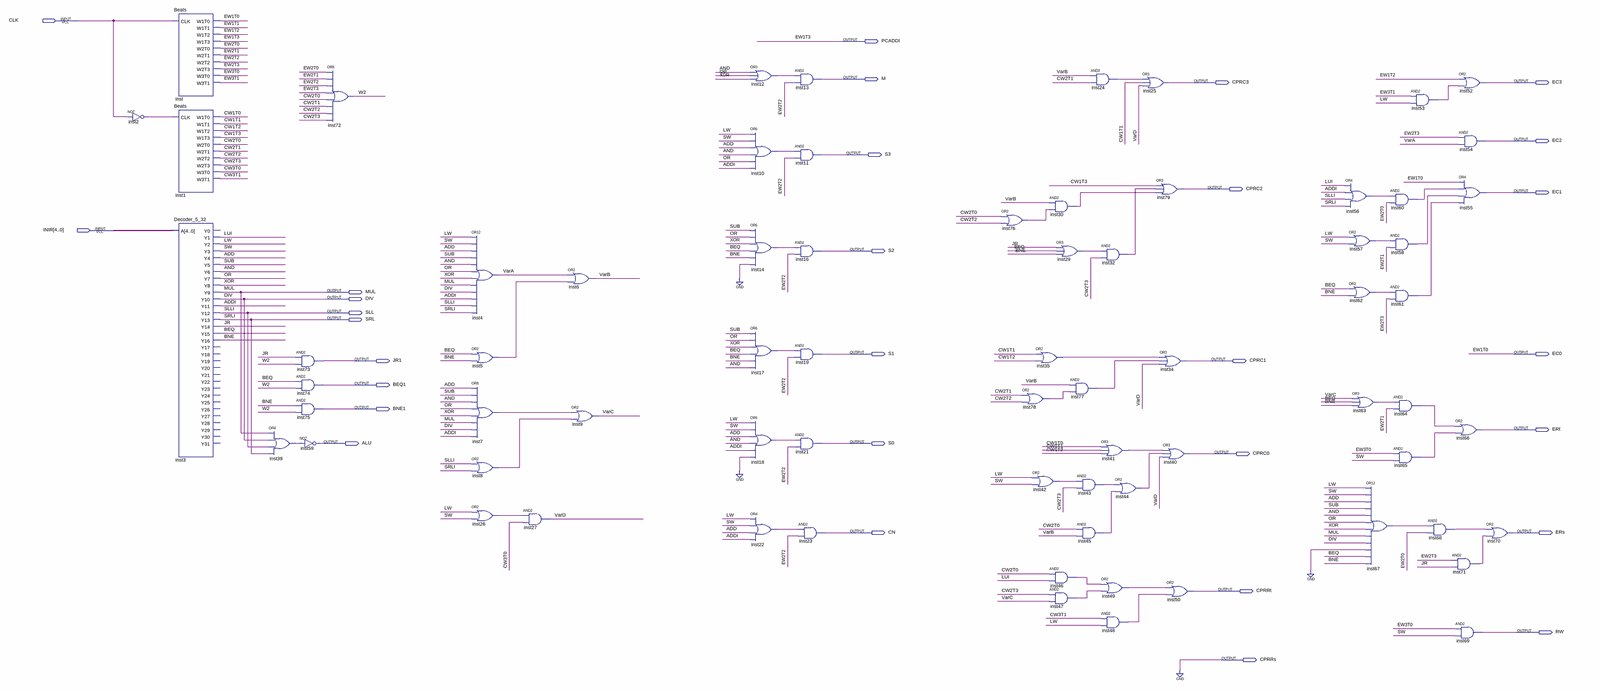
[diagram p0: schematic sheet, whole]
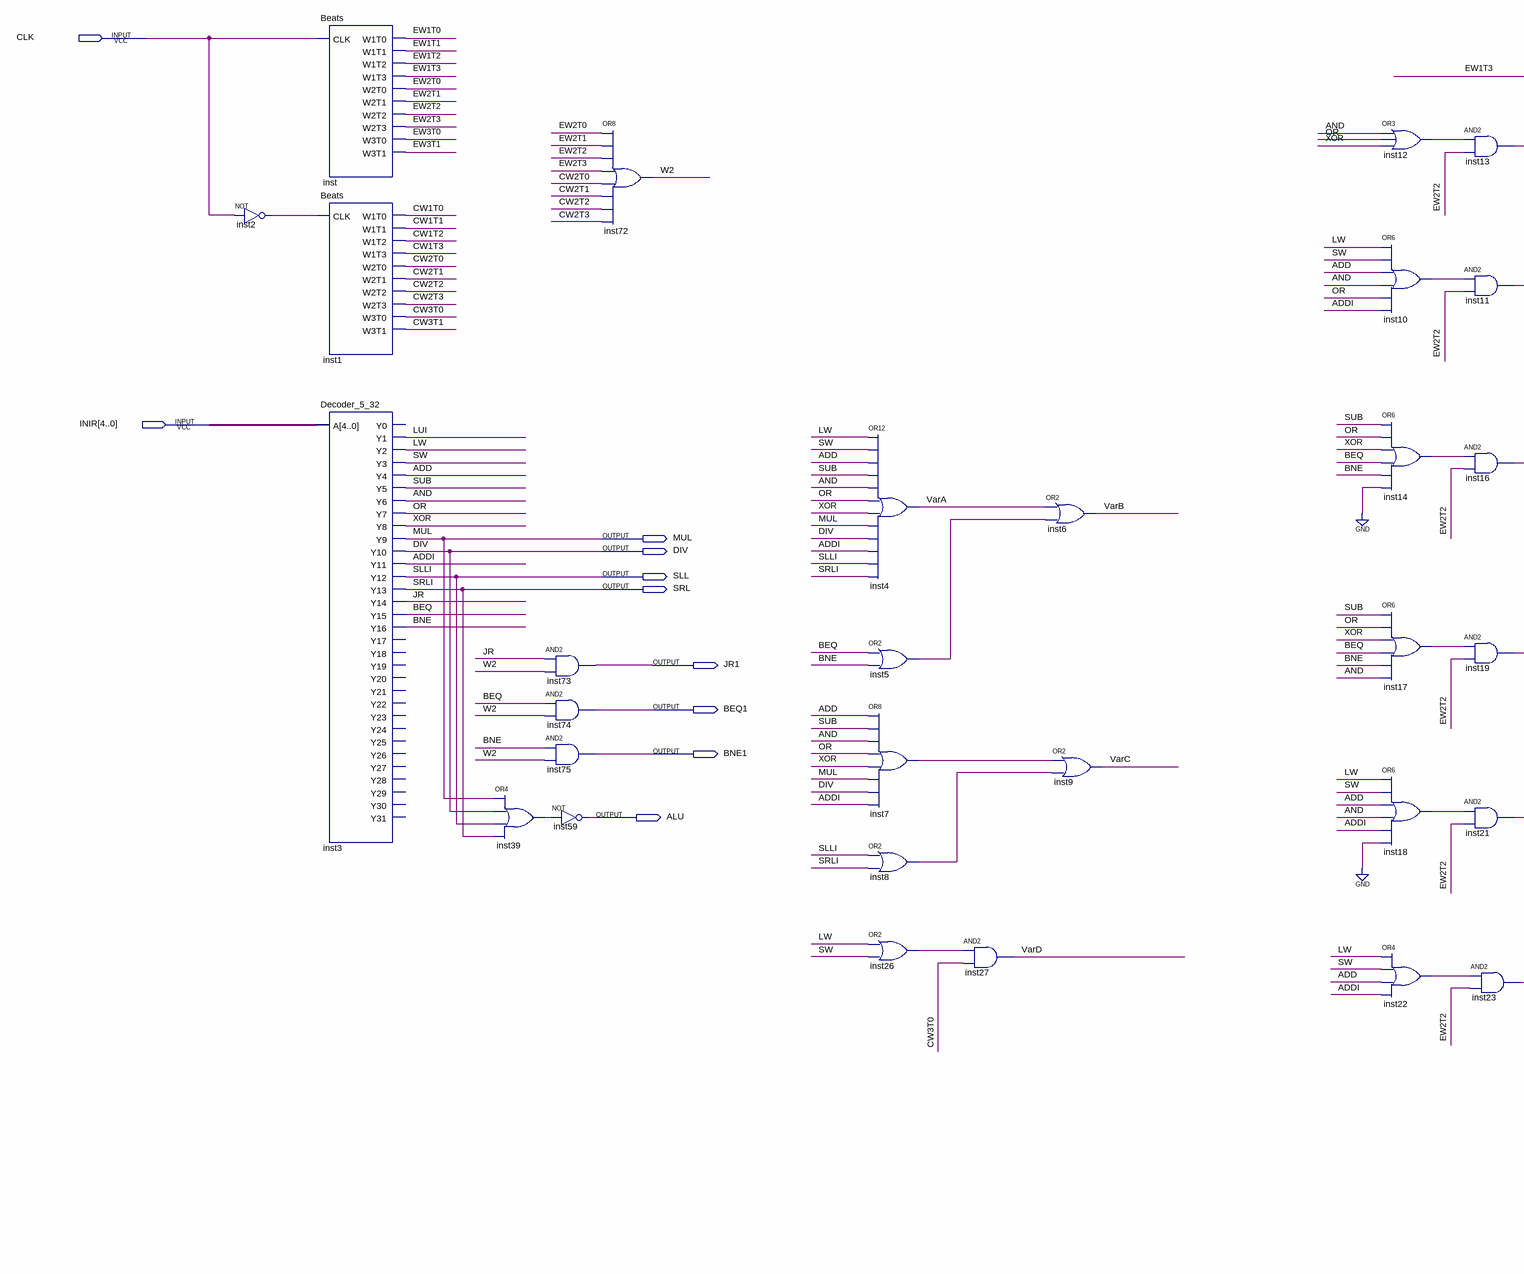
[diagram p1: schematic sheet, left part]
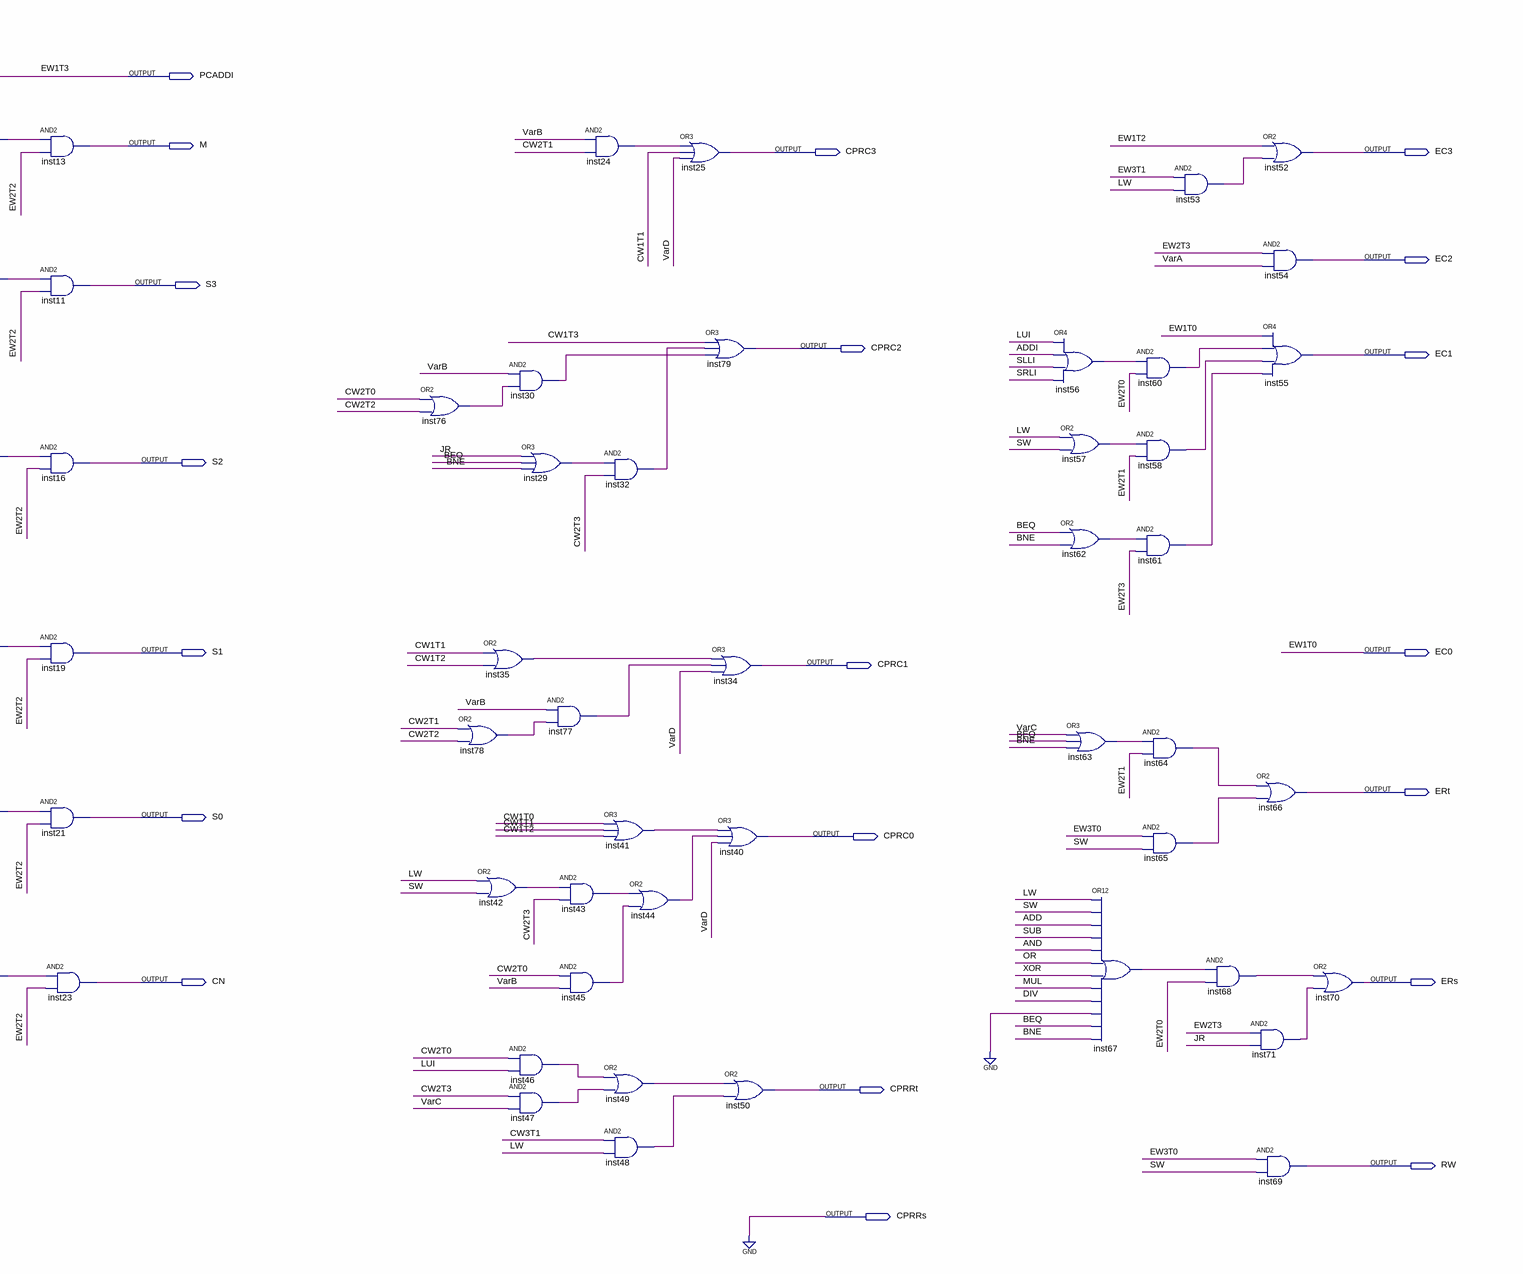
[diagram p2: schematic sheet, right part]
// Quartus schematic CU.bdf as structural Verilog: 71 symbols, 30 pins
module CU (
  input  CLK,
  input  [4:0] INIR,
  output PCADDI,
  output M,
  output CPRC3,
  output EC3,
  output EC2,
  output S3,
  output CPRC2,
  output EC1,
  output S2,
  output MUL,
  output DIV,
  output SLL,
  output SRL,
  output S1,
  output EC0,
  output JR1,
  output CPRC1,
  output BEQ1,
  output BNE1,
  output ERt,
  output ALU,
  output S0,
  output CPRC0,
  output CN,
  output ERs,
  output CPRRt,
  output RW,
  output CPRRs
);

  wire ADD, ADDI, AND, BEQ, BNE, CW1T0, CW1T1, CW1T2, CW1T3, CW2T0, CW2T1, CW2T2, CW2T3, CW3T0, CW3T1, EW1T1,
       EW1T2, EW2T0, EW2T1, EW2T2, EW2T3, EW3T0, EW3T1, inst2_out, inst5_out, inst7_out, inst8_out,
       inst10_out, inst12_out, inst14_out, inst17_out, inst18_out, inst22_out, inst24_out, inst26_out,
       inst29_out, inst30_out, inst32_out, inst35_out, inst39_out, inst41_out, inst42_out, inst43_out,
       inst44_out, inst45_out, inst46_out, inst47_out, inst48_out, inst49_out, inst53_out, inst56_out,
       inst57_out, inst58_out, inst60_out, inst61_out, inst62_out, inst63_out, inst64_out, inst65_out,
       inst67_out, inst68_out, inst71_out, inst76_out, inst77_out, inst78_out, JR, LUI, LW, OR, SUB, SW,
       VarA, VarB, VarC, VarD, W2, XOR;

  not inst2 (inst2_out, CLK);
  Beats inst (
    .CLK(CLK), .W1T0(EC0), .W1T1(EW1T1), .W1T2(EW1T2), .W1T3(PCADDI), .W2T0(EW2T0), .W2T1(EW2T1),
    .W2T2(EW2T2), .W2T3(EW2T3), .W3T0(EW3T0), .W3T1(EW3T1));
  Beats inst1 (
    .CLK(inst2_out), .W1T0(CW1T0), .W1T1(CW1T1), .W1T2(CW1T2), .W1T3(CW1T3), .W2T0(CW2T0), .W2T1(CW2T1),
    .W2T2(CW2T2), .W2T3(CW2T3), .W3T0(CW3T0), .W3T1(CW3T1));
  Decoder_5_32 inst3 (
    .A(INIR), .Y1(LUI), .Y2(LW), .Y3(SW), .Y4(ADD), .Y5(SUB), .Y6(AND), .Y7(OR), .Y8(XOR), .Y9(MUL),
    .Y10(DIV), .Y11(ADDI), .Y12(SLL), .Y13(SRL), .Y14(JR), .Y15(BEQ), .Y16(BNE));  // open: Y0, Y17, Y18, Y19, Y20, Y21, Y22, Y23, Y24, Y25, Y26, Y27, Y28, Y29, Y30, Y31
  or inst39 (inst39_out, MUL, DIV, SLL, SRL);
  and inst73 (JR1, JR, W2);
  and inst74 (BEQ1, BEQ, W2);
  and inst75 (BNE1, BNE, W2);
  not inst59 (ALU, inst39_out);
  or inst72 (W2, EW2T0, EW2T1, EW2T2, EW2T3, CW2T0, CW2T1, CW2T2, CW2T3);
  or inst4 (VarA, LW, SW, ADD, SUB, AND, OR, XOR, MUL, DIV, ADDI, SLL, SRL);
  or inst5 (inst5_out, BEQ, BNE);
  or inst7 (inst7_out, ADD, SUB, AND, OR, XOR, MUL, DIV, ADDI);
  or inst8 (inst8_out, SLL, SRL);
  or inst26 (inst26_out, LW, SW);
  and inst27 (VarD, inst26_out, CW3T0);
  or inst6 (VarB, VarA, inst5_out);
  or inst9 (VarC, inst7_out, inst8_out);
  or inst12 (inst12_out, AND, OR, XOR);
  or inst10 (inst10_out, LW, SW, ADD, AND, OR, ADDI);
  or inst14 (inst14_out, SUB, OR, XOR, BEQ, BNE, 1'b0);
  or inst17 (inst17_out, SUB, OR, XOR, BEQ, BNE, AND);
  or inst18 (inst18_out, LW, SW, ADD, AND, ADDI, 1'b0);
  or inst22 (inst22_out, LW, SW, ADD, ADDI);
  and inst13 (M, inst12_out, EW2T2);
  and inst11 (S3, inst10_out, EW2T2);
  and inst16 (S2, inst14_out, EW2T2);
  and inst19 (S1, inst17_out, EW2T2);
  and inst21 (S0, inst18_out, EW2T2);
  and inst23 (CN, inst22_out, EW2T2);
  or inst76 (inst76_out, CW2T0, CW2T2);
  or inst35 (inst35_out, CW1T1, CW1T2);
  or inst78 (inst78_out, CW2T1, CW2T2);
  or inst42 (inst42_out, LW, SW);
  and inst30 (inst30_out, VarB, inst76_out);
  or inst29 (inst29_out, JR, BEQ, BNE);
  and inst77 (inst77_out, VarB, inst78_out);
  and inst46 (inst46_out, CW2T0, LUI);
  and inst47 (inst47_out, CW2T3, VarC);
  and inst24 (inst24_out, VarB, CW2T1);
  and inst32 (inst32_out, inst29_out, CW2T3);
  or inst41 (inst41_out, CW1T0, CW1T1, CW1T2);
  and inst43 (inst43_out, inst42_out, CW2T3);
  and inst45 (inst45_out, CW2T0, VarB);
  or inst49 (inst49_out, inst46_out, inst47_out);
  and inst48 (inst48_out, CW3T1, LW);
  or inst44 (inst44_out, inst43_out, inst45_out);
  or inst25 (CPRC3, inst24_out, CW1T1, VarD);
  or inst79 (CPRC2, CW1T3, inst32_out, inst30_out);
  or inst34 (CPRC1, inst35_out, inst77_out, VarD);
  or inst40 (CPRC0, inst41_out, inst44_out, VarD);
  or inst50 (CPRRt, inst49_out, inst48_out);
  or inst56 (inst56_out, LUI, ADDI, SLL, SRL);
  or inst57 (inst57_out, LW, SW);
  or inst62 (inst62_out, BEQ, BNE);
  or inst63 (inst63_out, VarC, BEQ, BNE);
  or inst67 (inst67_out, LW, SW, ADD, SUB, AND, OR, XOR, MUL, DIV, 1'b0, BEQ, BNE);
  and inst60 (inst60_out, inst56_out, EW2T0);
  and inst58 (inst58_out, inst57_out, EW2T1);
  and inst61 (inst61_out, inst62_out, EW2T3);
  and inst64 (inst64_out, inst63_out, EW2T1);
  and inst65 (inst65_out, EW3T0, SW);
  and inst53 (inst53_out, EW3T1, LW);
  and inst68 (inst68_out, inst67_out, EW2T0);
  or inst52 (EC3, EW1T2, inst53_out);
  and inst54 (EC2, EW2T3, VarA);
  or inst55 (EC1, EC0, inst60_out, inst58_out, inst61_out);
  or inst66 (ERt, inst64_out, inst65_out);
  and inst71 (inst71_out, EW2T3, JR);
  and inst69 (RW, EW3T0, SW);
  or inst70 (ERs, inst68_out, inst71_out);

  assign CPRRs = 1'b0;

  // Other names for the same wires on the sheet: EW1T0 = EC0; EW1T3 = PCADDI; SLLI = SLL; SRLI = SRL
endmodule
